# Altium schematic sheet CPU_Board.SchDoc: CPU Board
size Tabloid; Date: 03/13/2023; Engineer: Terry D. Schevker; Revision: 1.0; SheetNumber: 1; SheetTotal: 8
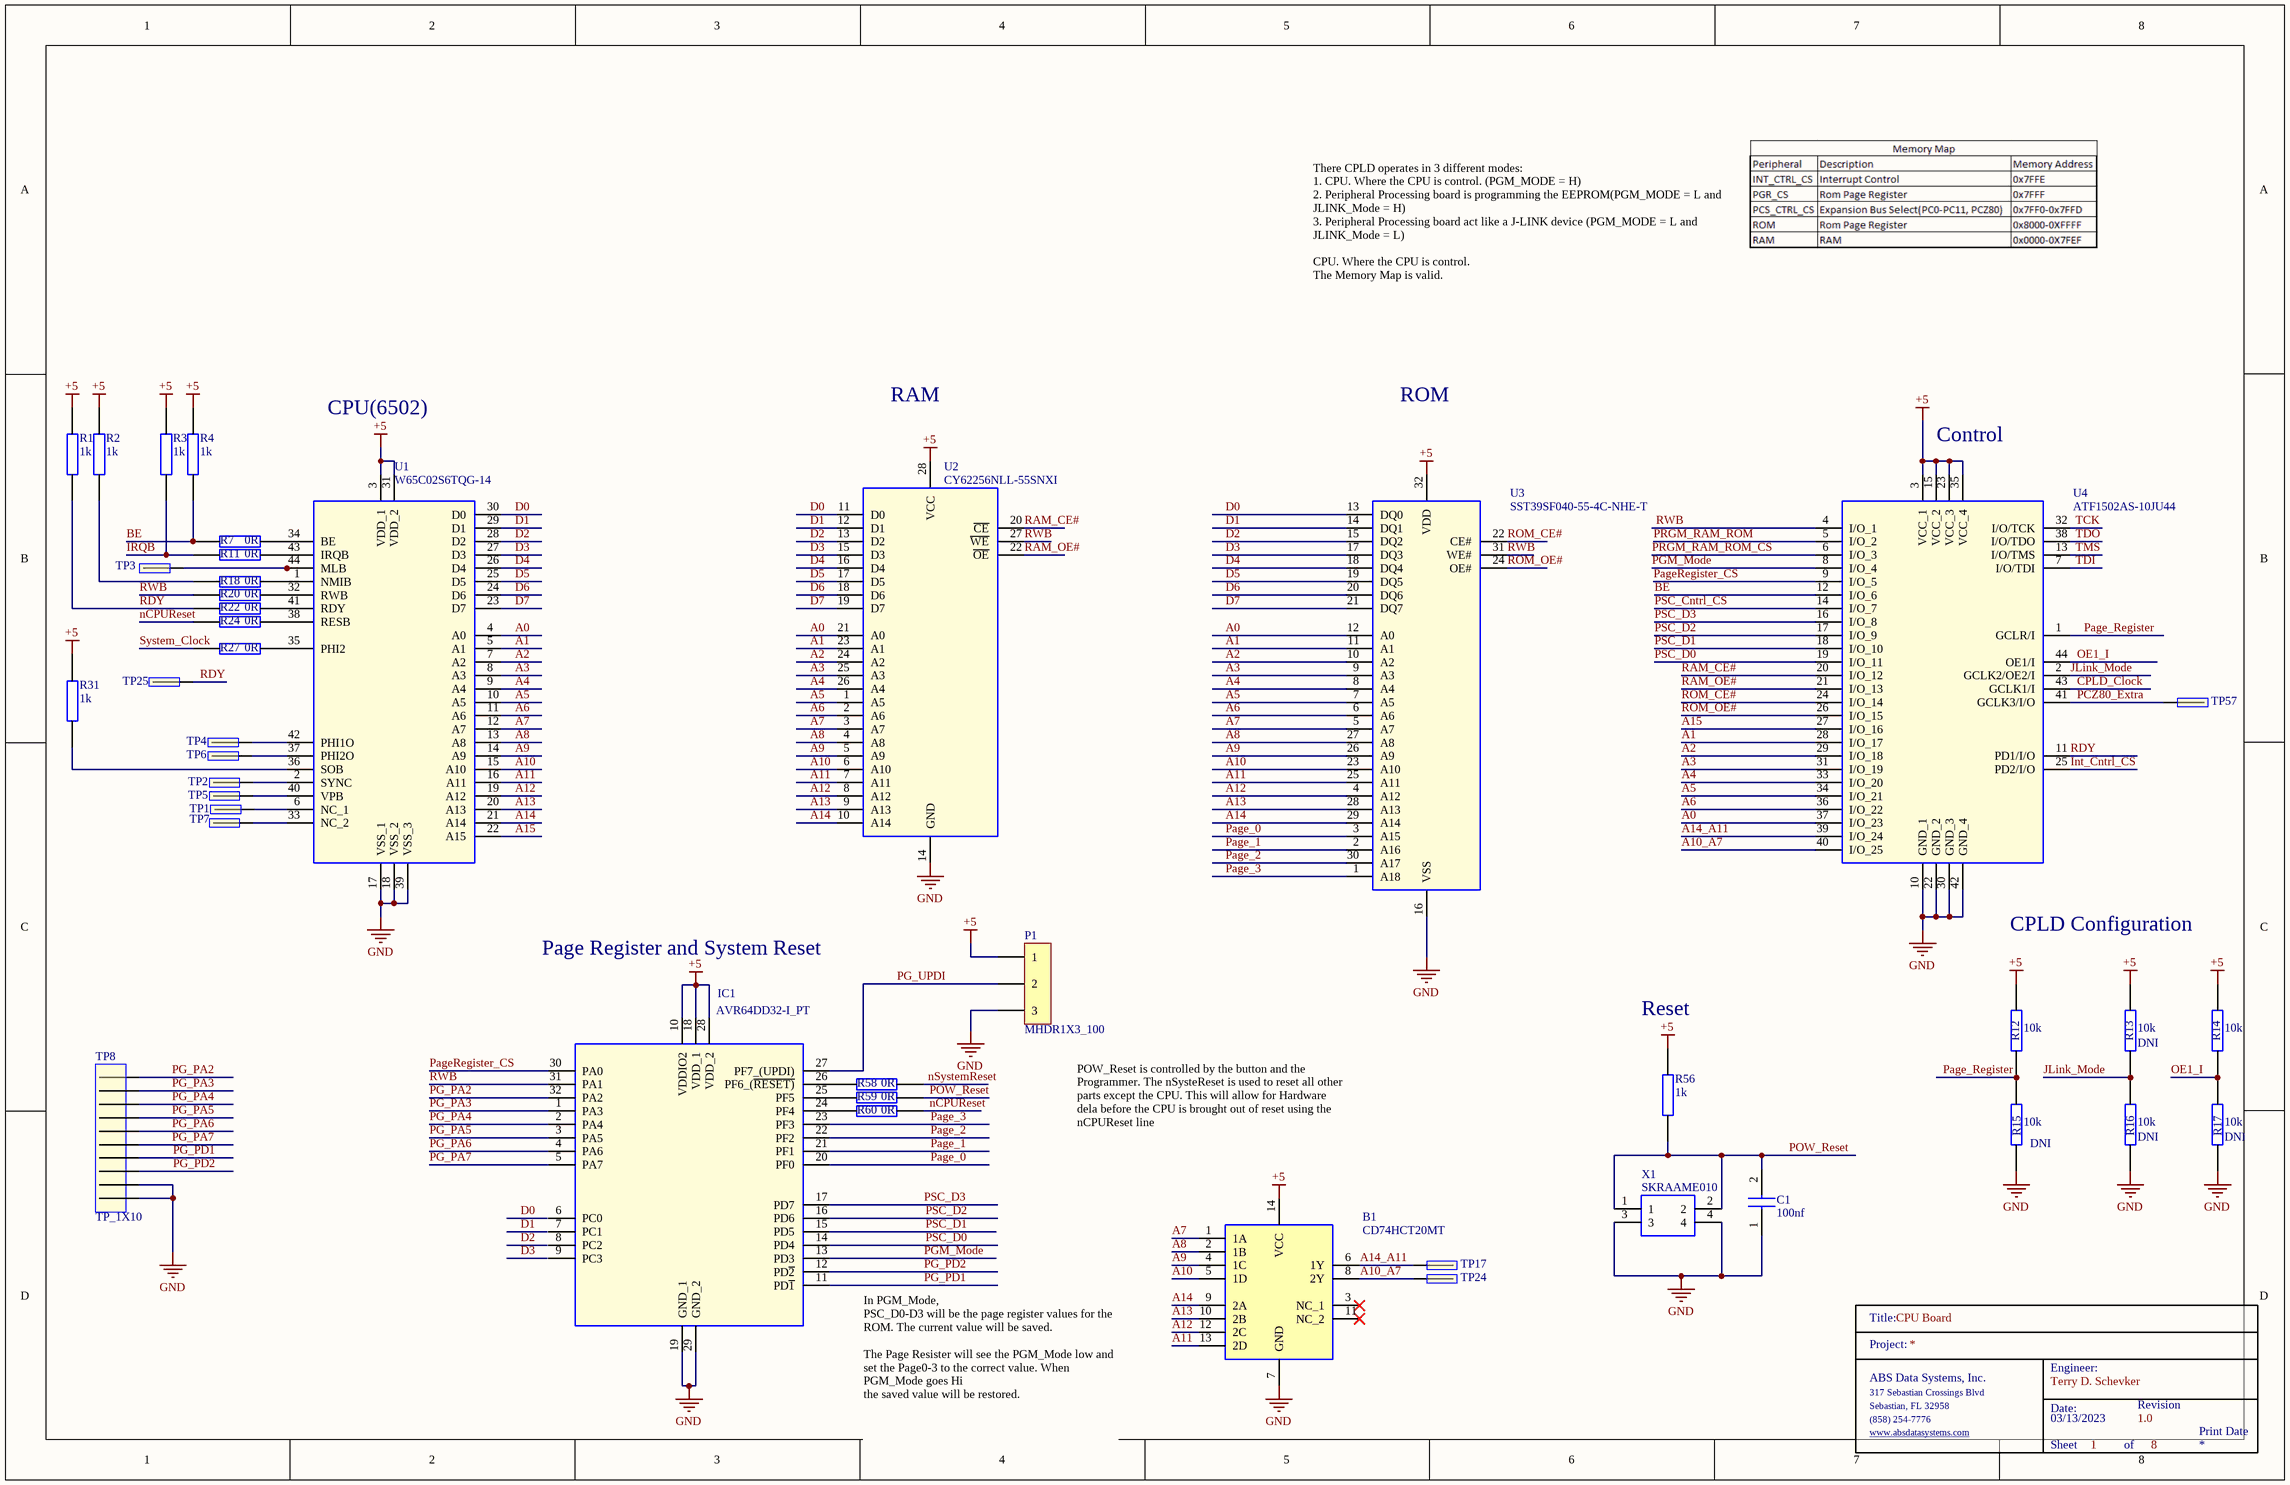
[diagram p0: CPU_Board.SchDoc]

## Parts
B1  CD74HCT20MT  [SOIC127P600X175-14N]
C1  100nf  [0603]
IC1  AVR64DD32-I_PT  [QFP80P900X900X120-32N]
P1  MHDR1X3_100  [MHDR1X3_100]
R1  1k  [0603]
R2  1k  [0603]
R3  1k  [0603]
R4  1k  [0603]
R7  0R  [0603]
R11  0R  [0603]
R12  10k  [0603]
R13  10k  [0603]
R14  10k  [0603]
R15  10k  [0603]
R16  10k  [0603]
R17  10k  [0603]
R18  0R  [0603]
R20  0R  [0603]
R22  0R  [0603]
R24  0R  [0603]
R27  0R  [0603]
R31  1k  [0603]
R56  1k  [0603]
R58  0R  [0603]
R59  0R  [0603]
R60  0R  [0603]
TitleBlock_1  TitleBlock  (value not drawn)  (graphical)
TP1  TP  [TP]  (value not drawn)
TP2  TP  [TP]  (value not drawn)
TP3  TP  [TP]  (value not drawn)
TP4  TP  [TP]  (value not drawn)
TP5  TP  [TP]  (value not drawn)
TP6  TP  [TP]  (value not drawn)
TP7  TP  [TP]  (value not drawn)
TP8  TP_1X10  [TP_1X10]
TP17  TP  [TP]  (value not drawn)
TP24  TP  [TP]  (value not drawn)
TP25  TP  [TP]  (value not drawn)
TP57  TP  [TP]  (value not drawn)
U1  W65C02S6TQG-14  [QFP-44]
U2  CY62256NLL-55SNXI  [SOP-28]
U3  SST39SF040-55-4C-NHE-T  [plcc-32]
U4  ATF1502AS-10JU44  [PLCC-44N]
X1  SKRAAME010  [SKRAAME010]

## Nets
+5: B1.14(VCC) IC1.10(VDDIO2) IC1.18(VDD_1) IC1.28(VDD_2) P1.1 R1.2 R2.2 R3.2 R4.2 R12.1 R13.1 R14.1 R31.2 R56.1 U1.3(VDD_1) U1.31(VDD_2) U2.28(VCC) U3.32(VDD) U4.3(VCC_1) U4.15(VCC_2) U4.23(VCC_3) U4.35(VCC_4)
GND: B1.7(GND) C1.1 IC1.19(GND_1) IC1.29(GND_2) P1.3 R15.2 R16.2 R17.2 TP8.9 TP8.10 U1.17(VSS_1) U1.18(VSS_2) U1.39(VSS_3) U2.14(GND) U3.16(VSS) U4.10(GND_1) U4.22(GND_2) U4.30(GND_3) U4.42(GND_4) X1.3 X1.4
A0: U1.4(A0) U2.21(A0) U3.12(A0) U4.37(I/O_23)
A1: U1.5(A1) U2.23(A1) U3.11(A1) U4.28(I/O_17)
A2: U1.7(A2) U2.24(A2) U3.10(A2) U4.29(I/O_18)
A3: U1.8(A3) U2.25(A3) U3.9(A3) U4.31(I/O_19)
A4: U1.9(A4) U2.26(A4) U3.8(A4) U4.33(I/O_20)
A5: U1.10(A5) U2.1(A5) U3.7(A5) U4.34(I/O_21)
A6: U1.11(A6) U2.2(A6) U3.6(A6) U4.36(I/O_22)
A7: B1.1(1A) U1.12(A7) U2.3(A7) U3.5(A7)
A8: B1.2(1B) U1.13(A8) U2.4(A8) U3.27(A8)
A9: B1.4(1C) U1.14(A9) U2.5(A9) U3.26(A9)
A10: B1.5(1D) U1.15(A10) U2.6(A10) U3.23(A10)
A10_A7: B1.8(2Y) TP24.1 U4.40(I/O_25)
A11: B1.13(2D) U1.16(A11) U2.7(A11) U3.25(A11)
A12: B1.12(2C) U1.19(A12) U2.8(A12) U3.4(A12)
A13: B1.10(2B) U1.20(A13) U2.9(A13) U3.28(A13)
A14: B1.9(2A) U1.21(A14) U2.10(A14) U3.29(A14)
A14_A11: B1.6(1Y) TP17.1 U4.39(I/O_24)
A15: U1.22(A15) U4.27(I/O_16)
BE: R4.1 R7.1 U4.12(I/O_6)
CPLD_Clock: U4.43(GCLK1/I)
D0: U1.30(D0) U2.11(D0) U3.13(DQ0)
D1: U1.29(D1) U2.12(D1) U3.14(DQ1)
D2: U1.28(D2) U2.13(D2) U3.15(DQ2)
D3: U1.27(D3) U2.15(D3) U3.17(DQ3)
D4: U1.26(D4) U2.16(D4) U3.18(DQ4)
D5: U1.25(D5) U2.17(D5) U3.19(DQ5)
D6: U1.24(D6) U2.18(D6) U3.20(DQ6)
D7: U1.23(D7) U2.19(D7) U3.21(DQ7)
Int_Cntrl_CS: U4.25(PD2/I/O)
IRQB: R3.1 R11.1
JLink_Mode: R13.2 R16.1 U4.2(GCLK2/OE2/I)
nCPUReset: R24.1 R60.2
nSystemReset: R58.2
OE1_I: R14.2 R17.1 U4.44(OE1/I)
Page_0: IC1.20(PF0) U3.3(A15)
Page_1: IC1.21(PF1) U3.2(A16)
Page_2: IC1.22(PF2) U3.30(A17)
Page_3: IC1.23(PF3) U3.1(A18)
Page_Register: R12.2 R15.1 U4.1(GCLR/I)
PageRegister_CS: IC1.30(PA0) U4.9(I/O_5)
PCZ80_Extra: TP57.1 U4.41(GCLK3/I/O)
PG_PA2: IC1.32(PA2) TP8.1
PG_PA3: IC1.1(PA3) TP8.2
PG_PA4: IC1.2(PA4) TP8.3
PG_PA5: IC1.3(PA5) TP8.4
PG_PA6: IC1.4(PA6) TP8.5
PG_PA7: IC1.5(PA7) TP8.6
PG_PD1: IC1.11(PD~{1}) TP8.7
PG_PD2: IC1.12(PD~{2}) TP8.8
PG_UPDI: IC1.27(PF7_(UPDI)) P1.2
PGM_Mode: IC1.13(PD3) U4.8(I/O_4)
POW_Reset: C1.2 R56.2 R59.2 X1.1 X1.2
PRGM_RAM_ROM: U4.5(I/O_2)
PRGM_RAM_ROM_CS: U4.6(I/O_3)
PSC_Cntrl_CS: U4.14(I/O_7)
PSC_D0: IC1.14(PD4) U4.19(I/O_11)
PSC_D1: IC1.15(PD5) U4.18(I/O_10)
PSC_D2: IC1.16(PD6) U4.17(I/O_9)
PSC_D3: IC1.17(PD7) U4.16(I/O_8)
RAM_CE#: U2.20(~{CE}) U4.20(I/O_12)
RAM_OE#: U2.22(~{OE}) U4.21(I/O_13)
RDY: R1.1 R22.1 TP25.1 U4.11(PD1/I/O)
ROM_CE#: U3.22(CE#) U4.24(I/O_14)
ROM_OE#: U3.24(OE#) U4.26(I/O_15)
RWB: IC1.31(PA1) R20.1 U2.27(~{WE}) U3.31(WE#) U4.4(I/O_1)
System_Clock: R27.1
TCK: U4.32(I/O/TCK)
TDI: U4.7(I/O/TDI)
TDO: U4.38(I/O/TDO)
TMS: U4.13(I/O/TMS)
NetIC1_24: IC1.24(PF4) R60.1
NetIC1_25: IC1.25(PF5) R59.1
NetIC1_26: IC1.26(PF6_(~{RESET)}) R58.1
NetR2_1: R2.1 R18.1
NetR7_2: R7.2 U1.34(BE)
NetR11_2: R11.2 U1.43(IRQB)
NetR18_2: R18.2 U1.1(NMIB)
NetR20_2: R20.2 U1.32(RWB)
NetR22_2: R22.2 U1.41(RDY)
NetR24_2: R24.2 U1.38(RESB)
NetR27_2: R27.2 U1.35(PHI2)
NetR31_1: R31.1 U1.36(SOB)
NetTP1_1: TP1.1 U1.6(NC_1)
NetTP2_1: TP2.1 U1.2(SYNC)
NetTP3_1: TP3.1 U1.44(MLB)
NetTP4_1: TP4.1 U1.42(PHI1O)
NetTP5_1: TP5.1 U1.40(VPB)
NetTP6_1: TP6.1 U1.37(PHI2O)
NetTP7_1: TP7.1 U1.33(NC_2)

Not connected (* = marked no-connect by the designer): B1 3(NC_1)* 11(NC_2)*; IC1 6(PC0) 7(PC1) 8(PC2) 9(PC3)

## Notes on the sheet
- There CPLD operates in 3 different modes:
  1. CPU. Where the CPU is control. (PGM_MODE = H)
  2. Peripheral Processing board is programming the EEPROM(PGM_MODE = L and JLINK_Mode = H)
  3. Peripheral Processing board act like a J-LINK device (PGM_MODE = L and JLINK_Mode = L)
  CPU. Where the CPU is control.
  The Memory Map is valid.
- CPU(6502)
- RAM
- ROM
- Control
- Page Register and System Reset
- CPLD Configuration
- Reset
- (near R13) DNI
- POW_Reset is controlled by the button and the Programmer. The nSysteReset is used to reset all other parts except the CPU. This will allow for Hardware dela before the CPU is brought out of reset using the nCPUReset line
- (near R15) DNI
- (near R16) DNI
- (near R17) DNI
- Print Date
- In PGM_Mode,
  PSC_D0-D3 will be the page register values for the
  ROM. The current value will be saved.
  The Page Resister will see the PGM_Mode low and set the Page0-3 to the correct value. When PGM_Mode goes Hi
  the saved value will be restored.
- (in symbol TitleBlock) Title:; Project:; Engineer:; ABS Data Systems, Inc.; 317 Sebastian Crossings Blvd; Sebastian, FL 32958; Date:; Revision; (858) 254-7776; www.absdatasystems.com; Sheet; of

## Library data of the parts
B1 = CD74HCT20MT: Texas Instruments CD74HCT20MT, Dual 4-Input NAND Logic Gate, 14-Pin SOIC; Geometry.Height: 1.75mm; Mouser Part Number: 595-CD74HCT20MT; Mouser Price/Stock: https://www.mouser.co.uk/ProductDetail/Texas-Instruments/CD74HCT20MT?qs=xFfolx0DHx2dg0PqLn7e%252Bw%3D%3D; Manufacturer_Name: Texas Instruments; Manufacturer_Part_Number: CD74HCT20MT; Datasheet Link: https://www.ti.com/general/docs/suppproductinfo.tsp?distId=10&gotoUrl=https%3A%2F%2Fwww.ti.com%2Flit%2Fgpn%2Fcd74hct20
C1 = CL10B104JB8NNNC: Samsung Electro-Mechanics 0603 100nf
IC1 = AVR64DD32-I_PT: Integrated Circuit; Manufacturer_Name: Microchip; Manufacturer_Part_Number: AVR64DD32-I/PT | MULTI-VOLTAGE I/O; Datasheet Link: https://www.microchip.com/en-us/product/AVR64DD32; Height: 1.2mm
P1 = MHDR1X3_100: Header, 3-Pin; LatestRevisionDate: 17-Jul-2002; LatestRevisionNote: Re-released for DXP Platform.; Publisher: Altium Limited
R1-R4 R31 R56 = AC0603FR-7W1KL: YAGEO 0603 1k ohm; Manufacturer_Name: KEMET; Manufacturer_Part_Number: RC0603JR-070RL; Geometry.Height: 0.55mm; Mouser Part Number: 603-RC0603JR-070RL; Mouser Price/Stock: https://www.mouser.co.uk/ProductDetail/YAGEO/RC0603JR-070RL?qs=2cAdsCoAWRGWyPcuXgGiXQ%3D%3D; Datasheet Link: https://datasheet.datasheetarchive.com/originals/distributors/Datasheets_SAMA/902f9e387b938f871d31120f5fc1d65e.pdf
R7 R11 R18 R20 R22 R24 R27 R58-R60 = RC0603JR-070RL: YAGEO 0603 0 ohm; Manufacturer_Name: KEMET; Geometry.Height: 0.55mm; Mouser Part Number: 603-RC0603JR-070RL; Mouser Price/Stock: https://www.mouser.co.uk/ProductDetail/YAGEO/RC0603JR-070RL?qs=2cAdsCoAWRGWyPcuXgGiXQ%3D%3D; Manufacturer_Part_Number: RC0603JR-070RL; Datasheet Link: https://datasheet.datasheetarchive.com/originals/distributors/Datasheets_SAMA/902f9e387b938f871d31120f5fc1d65e.pdf
R12-R17 = RC0603JR-0710KL: YAGEO 0603 10k ohm; Manufacturer_Name: KEMET; Manufacturer_Part_Number: RC0603JR-070RL; Geometry.Height: 0.55mm; Mouser Part Number: 603-RC0603JR-070RL; Mouser Price/Stock: https://www.mouser.co.uk/ProductDetail/YAGEO/RC0603JR-070RL?qs=2cAdsCoAWRGWyPcuXgGiXQ%3D%3D; Datasheet Link: https://datasheet.datasheetarchive.com/originals/distributors/Datasheets_SAMA/902f9e387b938f871d31120f5fc1d65e.pdf
TP1-TP7 TP17 TP24 TP25 TP57 = TP: Manufacturer: Samtec; Manufacturer Part Number: TST-105-01-G-D; Number of Contacts: 16; Gender: Male; Connector Type: Male Pin; Pitch: 2.54mm; Row Spacing: 0.1inch; Supplier 1: Digi-Key; RoHS: Yes; Category: Headers and Wire Housings; Stock 1: 227; Pricing 1: 1=2.85000, 10=2.73600, 100=2.28000, 500=1.93800, 1000=1.65300, 5000=1.48200 (USD); Mount: Through Hole; Contact Plating: Gold; Contact Material: Bronze; Housing Material: Polyester; Housing Color: Black; Color: Black; Min Operating Temperature: -55°C; Max Operating Temperature: 125°C; Number of Rows: 2; Termination: Solder; Packaging: Rail/Tube; Orientation: Straight; Number of Positions: 16; Length: 27.94mm; Depth: 9.27mm; Contact Mating Length: 0.25inch; REACH SVHC: No SVHC; ComponentLink1URL: https://datasheet.ciiva.com/739/tst-mkt-739845.pdf?src-supplier=Digi-Key; ComponentLink1Description: https://datasheet.ciiva.com/739/tst-mkt-739845.pdf?src-supplier=Digi-Key; ComponentLink2URL: https://datasheet.ciiva.com/10018/htst-10018510.pdf?src-supplier=Avnet; ComponentLink2Description: https://datasheet.ciiva.com/10018/htst-10018510.pdf?src-supplier=Avnet
TP8 = TP_1X10: Manufacturer: Samtec; Manufacturer Part Number: TST-105-01-G-D; Number of Contacts: 16; Gender: Male; Connector Type: Male Pin; Pitch: 2.54mm; Row Spacing: 0.1inch; Supplier 1: Digi-Key; RoHS: Yes; Category: Headers and Wire Housings; Stock 1: 227; Pricing 1: 1=2.85000, 10=2.73600, 100=2.28000, 500=1.93800, 1000=1.65300, 5000=1.48200 (USD); Mount: Through Hole; Contact Plating: Gold; Contact Material: Bronze; Housing Material: Polyester; Housing Color: Black; Color: Black; Min Operating Temperature: -55°C; Max Operating Temperature: 125°C; Number of Rows: 2; Termination: Solder; Packaging: Rail/Tube; Orientation: Straight; Number of Positions: 16; Length: 27.94mm; Depth: 9.27mm; Contact Mating Length: 0.25inch; REACH SVHC: No SVHC; ComponentLink1URL: https://datasheet.ciiva.com/739/tst-mkt-739845.pdf?src-supplier=Digi-Key; ComponentLink1Description: https://datasheet.ciiva.com/739/tst-mkt-739845.pdf?src-supplier=Digi-Key; ComponentLink2URL: https://datasheet.ciiva.com/10018/htst-10018510.pdf?src-supplier=Avnet; ComponentLink2Description: https://datasheet.ciiva.com/10018/htst-10018510.pdf?src-supplier=Avnet
U1 = W65C02S6TQG-14: Microprocessors - MPU 8-bit Microprocessor; Manufacturer_Name: Western Design Center (WDC); Geometry.Height: 2.7mm; Mouser Part Number: 955-W65C02S6TQG-14; Mouser Price/Stock: https://www.mouser.co.uk/ProductDetail/Western-Design-Center-WDC/W65C02S6TQG-14?qs=opBjA1TV900Cx5CoX8hQeQ%3D%3D; Manufacturer_Part_Number: W65C02S6TQG-14; Datasheet Link: http://www.westerndesigncenter.com/wdc/documentation/w65c02s.pdf
U2 = CY62256NLL-55SNXI: SRAM 256K 32K x 8 4.5-5.5V 28pin 330mil SOP Industrial (-40 85 C) Low Power Asynch; Manufacturer_Name: Alliance Memory; Geometry.Height: 2.794mm; Mouser Part Number: 913-CY62256NLL55SNXI; Mouser Price/Stock: https://www.mouser.co.uk/ProductDetail/Alliance-Memory/CY62256NLL-55SNXI?qs=byeeYqUIh0Pp3ev9t84NaQ%3D%3D; Manufacturer_Part_Number: CY62256NLL-55SNXI; Datasheet Link: https://www.cypress.com/file/43841/download
U3 = SST39SF040-55-4C-NHE-T: NOR Flash 4.5 to 5.5 1Mbit Multi-Purpose Flash; MicroChip Part Number: SST39SF040-55-4C-NHE-T; Supplier: Mouser; Mouser Part Number: 579-39SF040554CNHET
U4 = ATF1502AS-10JU44: ATF1502AS-10JU44, CPLD ATF1502AS EEPROM 32 Cells, 32 I/O, 2 Labs, 10ns, ISP, 4.75  5.25 V 44-Pin PLCC; Manufacturer_Name: Microchip; Geometry.Height: 4.572mm; Mouser Part Number: 556-AF1502AS10JU44; Mouser Price/Stock: https://www.mouser.co.uk/ProductDetail/Microchip-Technology-Atmel/ATF1502AS-10JU44?qs=fH4tvdCgwtOmGOXETrb9sw%3D%3D; Manufacturer_Part_Number: ATF1502AS-10JU44; Datasheet Link: http://ww1.microchip.com/downloads/en/DeviceDoc/Atmel-0995-CPLD-ATF1502AS(L)-Datasheet.pdf
X1 = SKRAAME010: ALPS - SKRAAME010 - SWITCH, SMD, 1.96N, 6.2X6.2MM; Manufacturer_Name: ALPS Electric; Geometry.Height: 5.3mm; Mouser Part Number: 688-SKRAAME010; Mouser Price/Stock: https://www.mouser.com/Search/Refine.aspx?Keyword=688-SKRAAME010; Manufacturer_Part_Number: SKRAAME010; Datasheet Link: https://componentsearchengine.com/Datasheets/1/SKRAAME010.pdf